# EAGLE design TAStm32_v3 (EAGLE 9.6.0)
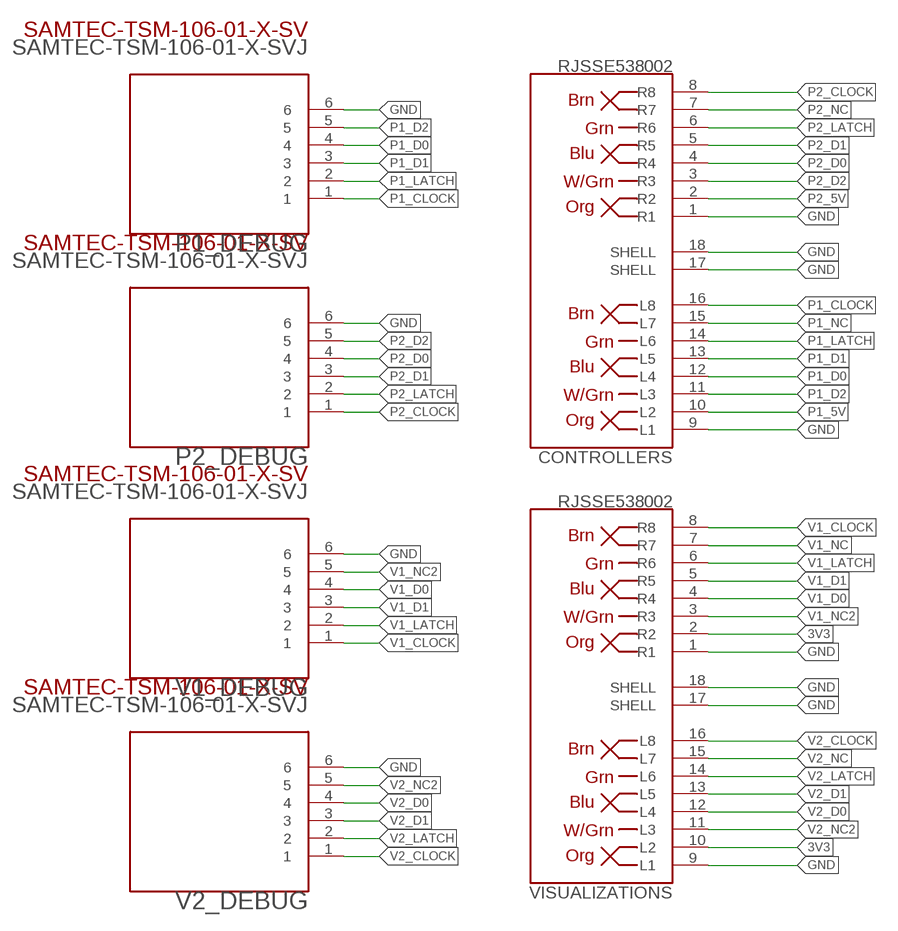
[diagram p0: schematic, sheet 1, part 1 of 2]
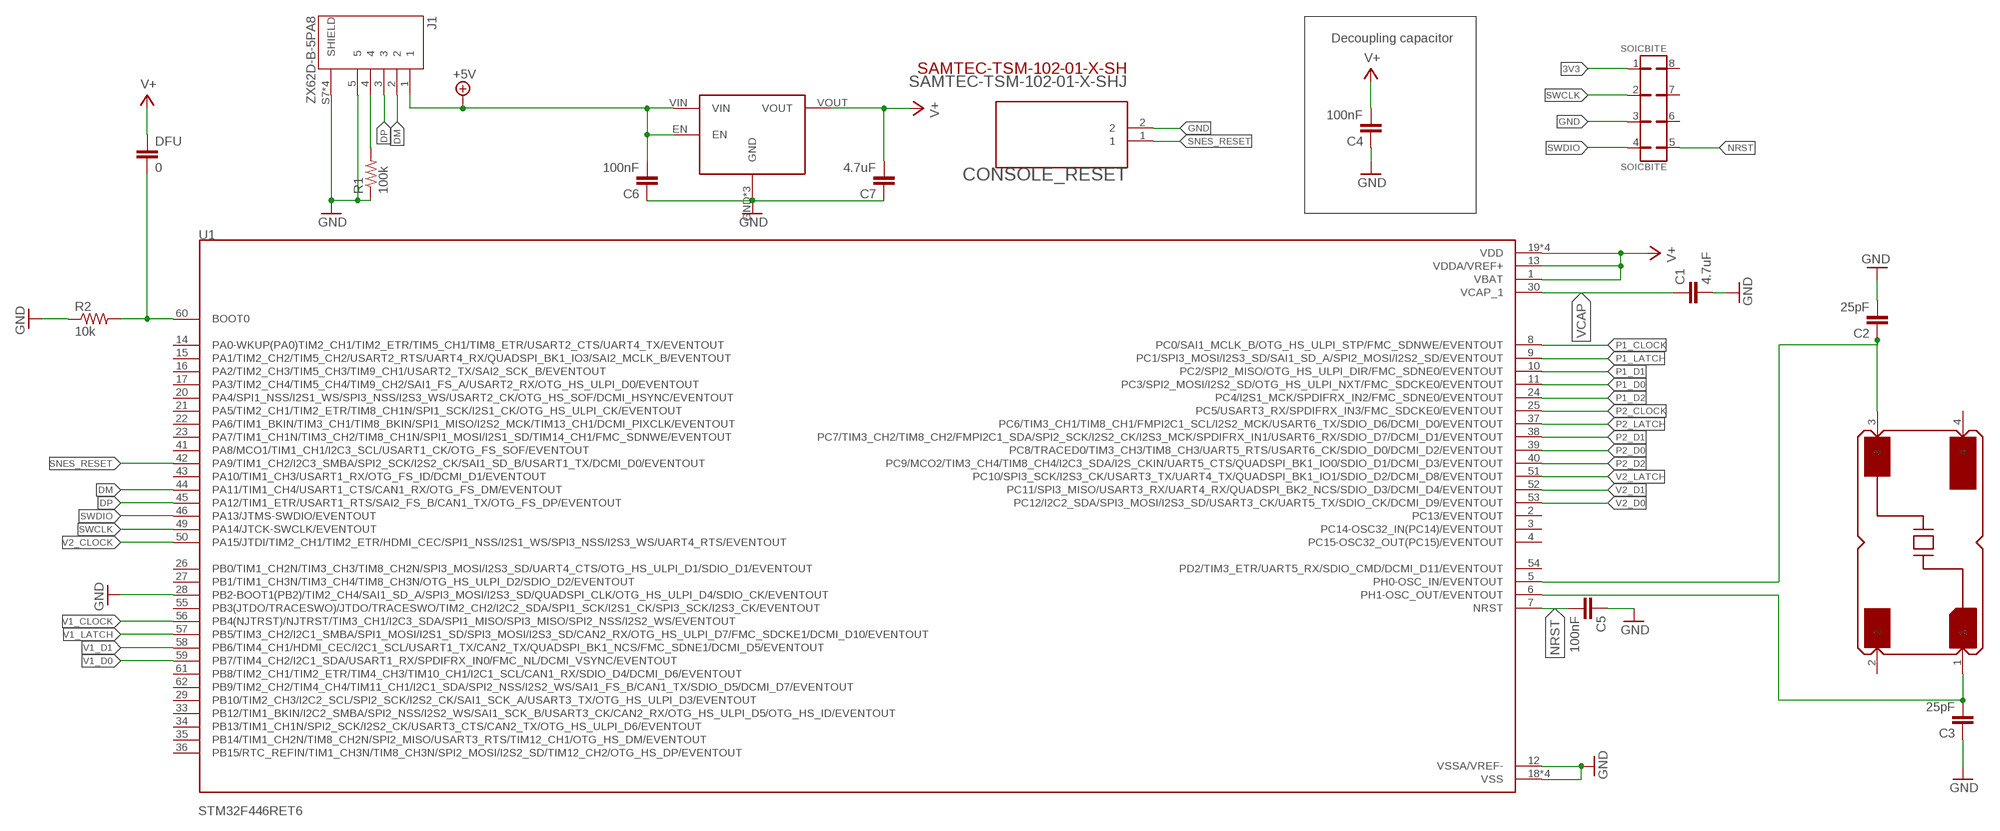
[diagram p1: schematic, sheet 1, part 2 of 2]

## Parts
C1  4.7uF  C-EUC0805K  [C0805K]
C2  25pF  C-EUC0805K  [C0805K]
C3  25pF  C-EUC0805K  [C0805K]
C4  100nF  C-EUC0805K  [C0805K]
C5  100nF  C-EUC0805K  [C0805K]
C6  100nF  C-EUC0805K  [C0805K]
C7  4.7uF  C-EUC0805K  [C0805K]
CONSOLE_RESET  SAMTEC-TSM-102-01-X-SHJ  [SAMTEC-TSM-102-01-X-SH]
CONTROLLERS  RJSSE538002  [AMPHENOL_RJSSE538002]
DFU  0  C-EUC0603  [C0603]
J1  ZX62D-B-5PA8  [HIROSE_ZX62D-B-5PA8]
P1_DEBUG  SAMTEC-TSM-106-01-X-SVJ  [SAMTEC-TSM-106-01-X-SV]
P2_DEBUG  SAMTEC-TSM-106-01-X-SVJ  [SAMTEC-TSM-106-01-X-SV]
R1  100k  R-US_R0805  [R0805]
R2  10k  R-US_R0805  [R0805]
SOICBITE  SOICBITE  [SOICBITE]
U1  STM32F446RET6  [QFP50P1200X1200X160-64N]
V1_DEBUG  SAMTEC-TSM-106-01-X-SVJ  [SAMTEC-TSM-106-01-X-SV]
V2_DEBUG  SAMTEC-TSM-106-01-X-SVJ  [SAMTEC-TSM-106-01-X-SV]
V_REG  S-1172B33-U5T1G  [S-1172B33-U5T1G]
VISUALIZATIONS  RJSSE538002  [AMPHENOL_RJSSE538002]
XTAL  ABMM-8.000MHZ-B2-T  [DFN-4]

## Nets
3V3: C4.2 C7.2 DFU.1 SOICBITE.1 U1.1(VBAT) U1.13(VDDA/VREF+) U1.19(VDD) U1.32(VDD) U1.48(VDD) U1.64(VDD) V_REG.VOUT VISUALIZATIONS.2(R2) VISUALIZATIONS.10(L2) ; supply symbol labelled V+
+5V: C6.2 J1.1 V_REG.EN V_REG.VIN
BOOT0: DFU.2 R2.2 U1.60(BOOT0)
DM: J1.2 U1.44(PA11/TIM1_CH4/USART1_CTS/CAN1_RX/OTG_FS_DM/EVENTOUT)
DP: J1.3 U1.45(PA12/TIM1_ETR/USART1_RTS/SAI2_FS_B/CAN1_TX/OTG_FS_DP/EVENTOUT)
GND: C1.2 C2.2 C3.1 C4.1 C5.1 C6.1 C7.1 CONSOLE_RESET.2 CONTROLLERS.1(R1) CONTROLLERS.9(L1) CONTROLLERS.17(SHELL) CONTROLLERS.18(SHELL) J1.5 J1.S7(SHIELD) J1.S8(SHIELD) J1.S9(SHIELD) J1.S10(SHIELD) P1_DEBUG.6 P2_DEBUG.6 R1.1 R2.1 SOICBITE.3 U1.12(VSSA/VREF-) U1.18(VSS) U1.28(PB2-BOOT1(PB2)/TIM2_CH4/SAI1_SD_A/SPI3_MOSI/I2S3_SD/QUADSPI_CLK/OTG_HS_ULPI_D4/SDIO_CK/EVENTOUT) U1.31(VSS) U1.47(VSS) U1.63(VSS) V1_DEBUG.6 V2_DEBUG.6 V_REG.GND V_REG.GND2(GND) V_REG.GND3(GND) VISUALIZATIONS.1(R1) VISUALIZATIONS.9(L1) VISUALIZATIONS.17(SHELL) VISUALIZATIONS.18(SHELL)
ID: J1.4 R1.2
NRST: C5.2 SOICBITE.5 U1.7(NRST)
P1_5V: CONTROLLERS.10(L2)
P1_CLOCK: CONTROLLERS.16(L8) P1_DEBUG.1 U1.8(PC0/SAI1_MCLK_B/OTG_HS_ULPI_STP/FMC_SDNWE/EVENTOUT)
P1_D0: CONTROLLERS.12(L4) P1_DEBUG.4 U1.11(PC3/SPI2_MOSI/I2S2_SD/OTG_HS_ULPI_NXT/FMC_SDCKE0/EVENTOUT)
P1_D1: CONTROLLERS.13(L5) P1_DEBUG.3 U1.10(PC2/SPI2_MISO/OTG_HS_ULPI_DIR/FMC_SDNE0/EVENTOUT)
P1_D2: CONTROLLERS.11(L3) P1_DEBUG.5 U1.24(PC4/I2S1_MCK/SPDIFRX_IN2/FMC_SDNE0/EVENTOUT)
P1_LATCH: CONTROLLERS.14(L6) P1_DEBUG.2 U1.9(PC1/SPI3_MOSI/I2S3_SD/SAI1_SD_A/SPI2_MOSI/I2S2_SD/EVENTOUT)
P1_NC: CONTROLLERS.15(L7)
P2_5V: CONTROLLERS.2(R2)
P2_CLOCK: CONTROLLERS.8(R8) P2_DEBUG.1 U1.25(PC5/USART3_RX/SPDIFRX_IN3/FMC_SDCKE0/EVENTOUT)
P2_D0: CONTROLLERS.4(R4) P2_DEBUG.4 U1.39(PC8/TRACED0/TIM3_CH3/TIM8_CH3/UART5_RTS/USART6_CK/SDIO_D0/DCMI_D2/EVENTOUT)
P2_D1: CONTROLLERS.5(R5) P2_DEBUG.3 U1.38(PC7/TIM3_CH2/TIM8_CH2/FMPI2C1_SDA/SPI2_SCK/I2S2_CK/I2S3_MCK/SPDIFRX_IN1/USART6_RX/SDIO_D7/DCMI_D1/EVENTOUT)
P2_D2: CONTROLLERS.3(R3) P2_DEBUG.5 U1.40(PC9/MCO2/TIM3_CH4/TIM8_CH4/I2C3_SDA/I2S_CKIN/UART5_CTS/QUADSPI_BK1_IO0/SDIO_D1/DCMI_D3/EVENTOUT)
P2_LATCH: CONTROLLERS.6(R6) P2_DEBUG.2 U1.37(PC6/TIM3_CH1/TIM8_CH1/FMPI2C1_SCL/I2S2_MCK/USART6_TX/SDIO_D6/DCMI_D0/EVENTOUT)
P2_NC: CONTROLLERS.7(R7)
SNES_RESET: CONSOLE_RESET.1 U1.42(PA9/TIM1_CH2/I2C3_SMBA/SPI2_SCK/I2S2_CK/SAI1_SD_B/USART1_TX/DCMI_D0/EVENTOUT)
SWCLK: SOICBITE.2 U1.49(PA14/JTCK-SWCLK/EVENTOUT)
SWDIO: SOICBITE.4 U1.46(PA13/JTMS-SWDIO/EVENTOUT)
V1_CLOCK: U1.56(PB4(NJTRST)/NJTRST/TIM3_CH1/I2C3_SDA/SPI1_MISO/SPI3_MISO/SPI2_NSS/I2S2_WS/EVENTOUT) V1_DEBUG.1 VISUALIZATIONS.8(R8)
V1_D0: U1.59(PB7/TIM4_CH2/I2C1_SDA/USART1_RX/SPDIFRX_IN0/FMC_NL/DCMI_VSYNC/EVENTOUT) V1_DEBUG.4 VISUALIZATIONS.4(R4)
V1_D1: U1.58(PB6/TIM4_CH1/HDMI_CEC/I2C1_SCL/USART1_TX/CAN2_TX/QUADSPI_BK1_NCS/FMC_SDNE1/DCMI_D5/EVENTOUT) V1_DEBUG.3 VISUALIZATIONS.5(R5)
V1_LATCH: U1.57(PB5/TIM3_CH2/I2C1_SMBA/SPI1_MOSI/I2S1_SD/SPI3_MOSI/I2S3_SD/CAN2_RX/OTG_HS_ULPI_D7/FMC_SDCKE1/DCMI_D10/EVENTOUT) V1_DEBUG.2 VISUALIZATIONS.6(R6)
V1_NC: VISUALIZATIONS.7(R7)
V1_NC2: V1_DEBUG.5 VISUALIZATIONS.3(R3)
V2_CLOCK: U1.50(PA15/JTDI/TIM2_CH1/TIM2_ETR/HDMI_CEC/SPI1_NSS/I2S1_WS/SPI3_NSS/I2S3_WS/UART4_RTS/EVENTOUT) V2_DEBUG.1 VISUALIZATIONS.16(L8)
V2_D0: U1.53(PC12/I2C2_SDA/SPI3_MOSI/I2S3_SD/USART3_CK/UART5_TX/SDIO_CK/DCMI_D9/EVENTOUT) V2_DEBUG.4 VISUALIZATIONS.12(L4)
V2_D1: U1.52(PC11/SPI3_MISO/USART3_RX/UART4_RX/QUADSPI_BK2_NCS/SDIO_D3/DCMI_D4/EVENTOUT) V2_DEBUG.3 VISUALIZATIONS.13(L5)
V2_LATCH: U1.51(PC10/SPI3_SCK/I2S3_CK/USART3_TX/UART4_TX/QUADSPI_BK1_IO1/SDIO_D2/DCMI_D8/EVENTOUT) V2_DEBUG.2 VISUALIZATIONS.14(L6)
V2_NC: VISUALIZATIONS.15(L7)
V2_NC2: V2_DEBUG.5 VISUALIZATIONS.11(L3)
VCAP: C1.1 U1.30(VCAP_1)
XTAL1: C2.1 U1.5(PH0-OSC_IN/EVENTOUT) XTAL.3
XTAL2: C3.2 U1.6(PH1-OSC_OUT/EVENTOUT) XTAL.1
Unconnected: SOICBITE.6 SOICBITE.7 SOICBITE.8 U1.2(PC13/EVENTOUT) U1.3(PC14-OSC32_IN(PC14)/EVENTOUT) U1.4(PC15-OSC32_OUT(PC15)/EVENTOUT) U1.14(PA0-WKUP(PA0)TIM2_CH1/TIM2_ETR/TIM5_CH1/TIM8_ETR/USART2_CTS/UART4_TX/EVENTOUT) U1.15(PA1/TIM2_CH2/TIM5_CH2/USART2_RTS/UART4_RX/QUADSPI_BK1_IO3/SAI2_MCLK_B/EVENTOUT) U1.16(PA2/TIM2_CH3/TIM5_CH3/TIM9_CH1/USART2_TX/SAI2_SCK_B/EVENTOUT) U1.17(PA3/TIM2_CH4/TIM5_CH4/TIM9_CH2/SAI1_FS_A/USART2_RX/OTG_HS_ULPI_D0/EVENTOUT) U1.20(PA4/SPI1_NSS/I2S1_WS/SPI3_NSS/I2S3_WS/USART2_CK/OTG_HS_SOF/DCMI_HSYNC/EVENTOUT) U1.21(PA5/TIM2_CH1/TIM2_ETR/TIM8_CH1N/SPI1_SCK/I2S1_CK/OTG_HS_ULPI_CK/EVENTOUT) U1.22(PA6/TIM1_BKIN/TIM3_CH1/TIM8_BKIN/SPI1_MISO/I2S2_MCK/TIM13_CH1/DCMI_PIXCLK/EVENTOUT) U1.23(PA7/TIM1_CH1N/TIM3_CH2/TIM8_CH1N/SPI1_MOSI/I2S1_SD/TIM14_CH1/FMC_SDNWE/EVENTOUT) U1.26(PB0/TIM1_CH2N/TIM3_CH3/TIM8_CH2N/SPI3_MOSI/I2S3_SD/UART4_CTS/OTG_HS_ULPI_D1/SDIO_D1/EVENTOUT) U1.27(PB1/TIM1_CH3N/TIM3_CH4/TIM8_CH3N/OTG_HS_ULPI_D2/SDIO_D2/EVENTOUT) U1.29(PB10/TIM2_CH3/I2C2_SCL/SPI2_SCK/I2S2_CK/SAI1_SCK_A/USART3_TX/OTG_HS_ULPI_D3/EVENTOUT) U1.33(PB12/TIM1_BKIN/I2C2_SMBA/SPI2_NSS/I2S2_WS/SAI1_SCK_B/USART3_CK/CAN2_RX/OTG_HS_ULPI_D5/OTG_HS_ID/EVENTOUT) U1.34(PB13/TIM1_CH1N/SPI2_SCK/I2S2_CK/USART3_CTS/CAN2_TX/OTG_HS_ULPI_D6/EVENTOUT) U1.35(PB14/TIM1_CH2N/TIM8_CH2N/SPI2_MISO/USART3_RTS/TIM12_CH1/OTG_HS_DM/EVENTOUT) U1.36(PB15/RTC_REFIN/TIM1_CH3N/TIM8_CH3N/SPI2_MOSI/I2S2_SD/TIM12_CH2/OTG_HS_DP/EVENTOUT) U1.41(PA8/MCO1/TIM1_CH1/I2C3_SCL/USART1_CK/OTG_FS_SOF/EVENTOUT) U1.43(PA10/TIM1_CH3/USART1_RX/OTG_FS_ID/DCMI_D1/EVENTOUT) U1.54(PD2/TIM3_ETR/UART5_RX/SDIO_CMD/DCMI_D11/EVENTOUT) U1.55(PB3(JTDO/TRACESWO)/JTDO/TRACESWO/TIM2_CH2/I2C2_SDA/SPI1_SCK/I2S1_CK/SPI3_SCK/I2S3_CK/EVENTOUT) U1.61(PB8/TIM2_CH1/TIM2_ETR/TIM4_CH3/TIM10_CH1/I2C1_SCL/CAN1_RX/SDIO_D4/DCMI_D6/EVENTOUT) U1.62(PB9/TIM2_CH2/TIM4_CH4/TIM11_CH1/I2C1_SDA/SPI2_NSS/I2S2_WS/SAI1_FS_B/CAN1_TX/SDIO_D5/DCMI_D7/EVENTOUT) XTAL.2 XTAL.4

## Notes on the sheet
- Decoupling capacitor

## Library data of the parts
C1-C7 DFU = rcl:C-EU: CAPACITOR, European symbol; SPICEPREFIX: C
CONSOLE_RESET = SAMTEC-TSM-102-01-X-SH:SAMTEC-TSM-102-01-X-SH; AVAILABILITY: Unavailable; DESCRIPTION: Connector Header Surface Mount, Right Angle 2 position 0.100 _2.54mm_; MF: Samtec; MP: TSM-102-01-F-SH; PACKAGE: None; PRICE: None
CONTROLLERS VISUALIZATIONS = RJSSE538002:RJSSE538002: Conn RJ-45 F 16 POS 1.27mm Solder RA SMD 16 Terminal 2 Port Cat 5; AVAILABILITY: Unavailable; DESCRIPTION: Jack Modular Connector 8p8c _RJ45, Ethernet_ 90° Angle _Right_ Shielded, EMI Finger; MF: Amphenol Commercial Products; MP: RJSSE538002; PACKAGE: None; PRICE: None
J1 = ZX62D-B-5PA8:ZX62D-B-5PA8: CONN RCPT USB; AVAILABILITY: Unavailable; DESCRIPTION: 5 Pin Single Port USB 2.0 Micro B Bottom Mount Through Hole Receptacle Male; MF: Hirose; MP: ZX62D-B-5PA8; PACKAGE: None; PRICE: None
P1_DEBUG P2_DEBUG V1_DEBUG V2_DEBUG = SAMTEC-TSM-106-01-X-SV:SAMTEC-TSM-106-01-X-SV; AVAILABILITY: Unavailable; DESCRIPTION: Connector Header Surface Mount 6 position 0.100 _2.54mm_; MF: Samtec; MP: TSM-106-01-L-SV; PACKAGE: None; PRICE: None
R1 R2 = rcl:R-US_: RESISTOR, American symbol; SPICEPREFIX: R
SOICBITE = SOICbite_Eagle:SOICBITE: SOICbite footprint Allows for direct clipping of a SOIC-8 Testclip onto a PCB edge for Programming/Debugging purposes without extra components. Original footprint created by: Simon Merrit Adapted to Eagle by: Chiel Voswijk (Foxhood) NOTE: Footprint is to be used on the edge of a PCB and may require the use of thin traces for accessing the inner pads. This may violate some Design Rules! One can often ignore these, but understand working is NOT guaranteed.
U1 = STM32F446RET6:STM32F446RET6: MCU 32-Bit STM32 ARM Cortex M4 RISC 512KB Flash 2.5V/3.3V 64-Pin LQFP Tray; DESCRIPTION: MCU 32-Bit STM32 ARM Cortex M4 RISC 512KB Flash 2.5V/3.3V 64-Pin LQFP Tray; MF: STMicroelectronics; MP: STM32F446RET6; PACKAGE: LQFP-64 STMicroelectronics
V_REG = S-1172B33-U5T1G:S-1172B33-U5T1G
XTAL = ABMM-8.000MHZ-B2-T:ABMM-8.000MHZ-B2-T: CRYSTAL 24MHZ 18PF SMD; AVAILABILITY: Good; DESCRIPTION: Crystal 8MHz ??20ppm _Tol_ ??50ppm _Stability_ 18pF FUND 70Ohm 4-Pin CSMD T/R; MF: Abracon; MP: ABMM-8.000MHZ-B2-T; PACKAGE: SMD-4 Abracon; PRICE: 0.61 USD

## Board
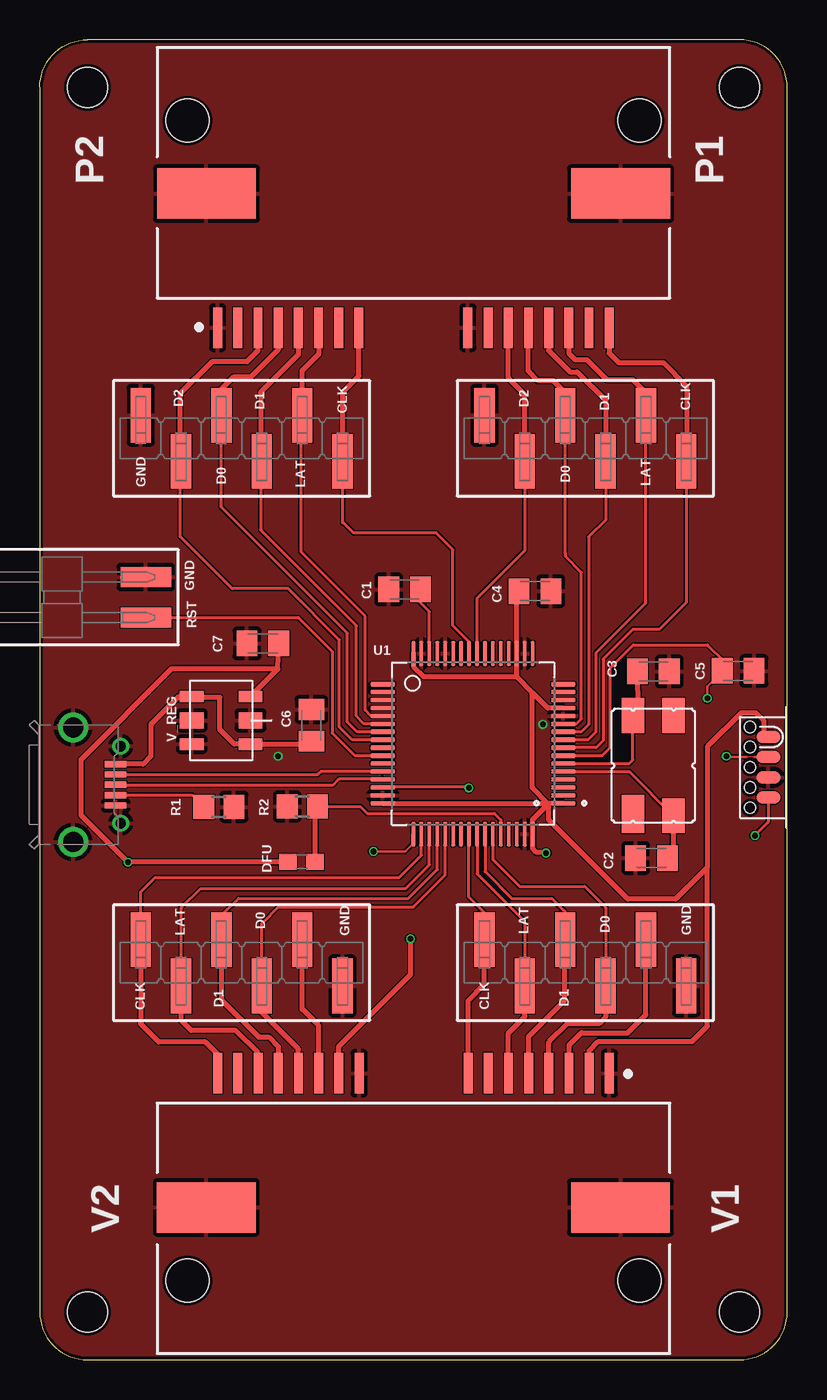
[diagram p2: board, top side]
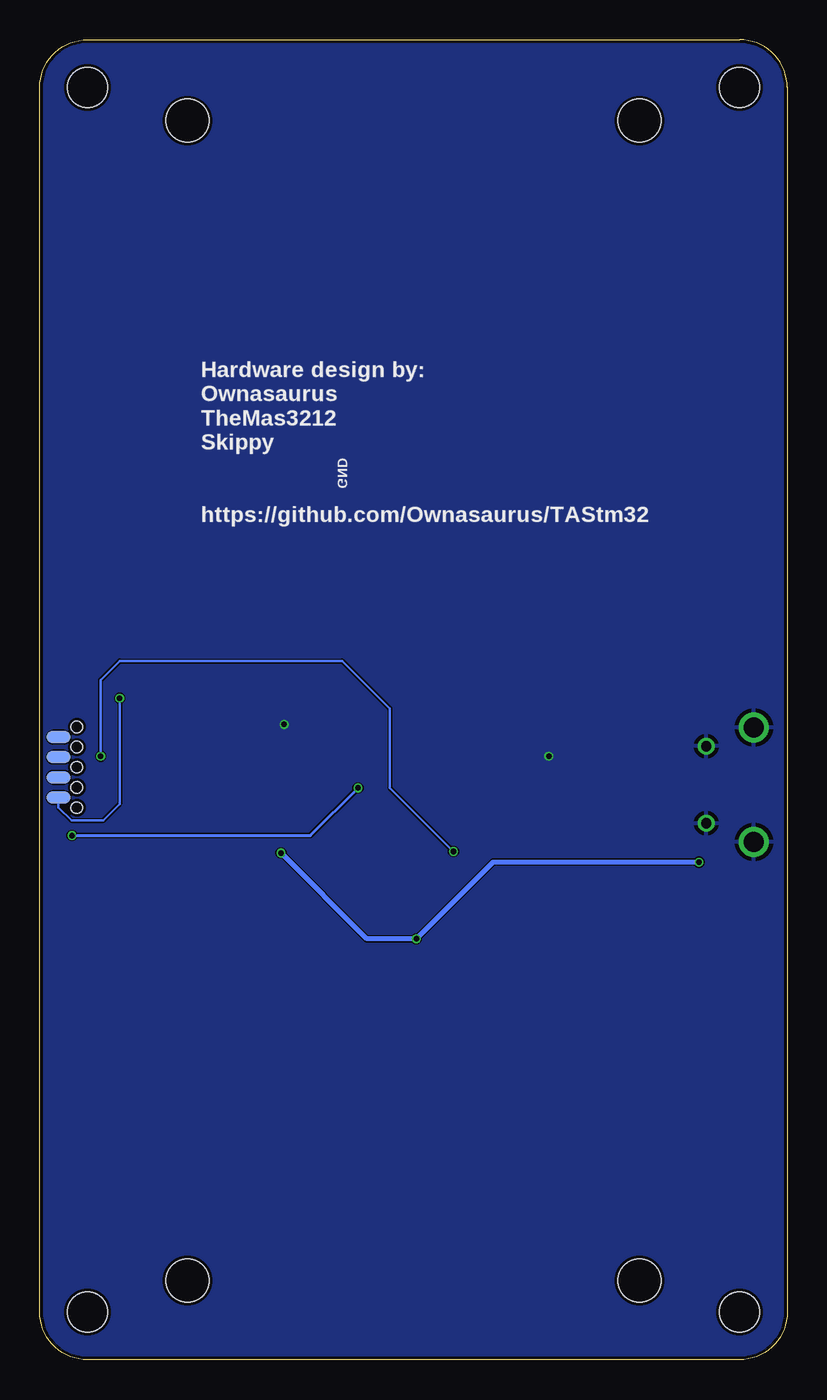
[diagram p3: board, bottom side, seen from below]

Size 47.03 x 83.08 mm. Coordinates in mm from the lower left corner, seen from the top.
Outline: 3,0 44.03,0 arc90 47.03,3 47.03,80.08 arc90 44.03,83.08 3,83.08 arc90 0,80.08 0,3 arc90 3,0
Copper layers (1*16): Top 0.035mm / dielectric 1.53mm / Bottom 0.035mm
Design rules "circuithub-minimum-design-rules-with-tented-vias": minimum track width 3mil, minimum drill 0.15mm, track to track 3mil, track to pad 3mil, pad to pad 3mil, via to via 3mil, smd to smd 3mil, copper to edge 8mil, drill to drill 8mil, minimum pad ring 4mil, minimum via ring 4mil, stop-mask expansion 4mil, vias tented up to drill 25mil, thermal gap 10mil
Holes 2.5 mm at 3,3 44.03,3 44.03,80.08 3,80.08

### Footprints (pad centres in the part's own frame; a part is rotated, then mirrored left to right if it is on the bottom)
C0805K = smd 1.3 x 1.6: 1 -1,0; 2 1,0
SAMTEC-TSM-102-01-X-SH = smd 1.27 x 3.18: 1 -1.27,-5.283; 2 1.27,-5.283
AMPHENOL_RJSSE538002 = smd 0.56 x 2.54: 1 12.325,13.04; 2 11.055,13.04; 3 9.785,13.04; 4 8.515,13.04; 5 7.245,13.04; 6 5.975,13.04; 7 4.705,13.04; 8 3.435,13.04; 9 -3.425,13.04; 10 -4.695,13.04; 11 -5.965,13.04; 12 -7.235,13.04; 13 -8.505,13.04; 14 -9.775,13.04; 15 -11.045,13.04; 16 -12.315,13.04 | smd 6.22 x 3.18: 17 -13.035,4.59; 18 13.025,4.59 | hole 2.69: -14.225,0; 14.225,0
C0603 = smd 1.1 x 1: 1 -0.85,0; 2 0.85,0
HIROSE_ZX62D-B-5PA8 = smd 1.35 x 0.4: 1 2.675,1.3; 2 2.675,0.65; 3 2.675,0; 4 2.675,-0.65; 5 2.675,-1.3 | drill 0.65 pad 1.05: S7 3,2.425; S8 3,-2.425 | drill 1.25 pad 1.9: S9 0,3.6; S10 0,-3.6
SAMTEC-TSM-106-01-X-SV = smd 1.27 x 3.43: 1 -6.35,1.46; 2 -3.81,-1.46; 3 -1.27,1.46; 4 1.27,-1.46; 5 3.81,1.46; 6 6.35,-1.46
R0805 = smd 1.3 x 1.5: 1 -0.95,0; 2 0.95,0
SOICBITE = smd 0.8 x 1.5: 1 1.905,0.75; 2 0.635,0.75; 3 -0.635,0.75; 4 -1.905,0.75 | smd 0.8 x 1.5 bottom: 5 -1.905,0.75; 6 -0.635,0.75; 7 0.635,0.75; 8 1.905,0.75 | hole 0.7: -2.54,1.905; -1.27,1.905; 0,1.905; 1.27,1.905; 2.54,1.905
QFP50P1200X1200X160-64N = smd 1.56 x 0.28: 1 -5.68,3.75; 2 -5.68,3.25; 3 -5.68,2.75; 4 -5.68,2.25; 5 -5.68,1.75; 6 -5.68,1.25; 7 -5.68,0.75; 8 -5.68,0.25; 9 -5.68,-0.25; 10 -5.68,-0.75; 11 -5.68,-1.25; 12 -5.68,-1.75; 13 -5.68,-2.25; 14 -5.68,-2.75; 15 -5.68,-3.25; 16 -5.68,-3.75; 33 5.68,-3.75; 34 5.68,-3.25; 35 5.68,-2.75; 36 5.68,-2.25; 37 5.68,-1.75; 38 5.68,-1.25; 39 5.68,-0.75; 40 5.68,-0.25; 41 5.68,0.25; 42 5.68,0.75; 43 5.68,1.25; 44 5.68,1.75; 45 5.68,2.25; 46 5.68,2.75; 47 5.68,3.25; 48 5.68,3.75 | smd 0.28 x 1.56: 17 -3.75,-5.68; 18 -3.25,-5.68; 19 -2.75,-5.68; 20 -2.25,-5.68; 21 -1.75,-5.68; 22 -1.25,-5.68; 23 -0.75,-5.68; 24 -0.25,-5.68; 25 0.25,-5.68; 26 0.75,-5.68; 27 1.25,-5.68; 28 1.75,-5.68; 29 2.25,-5.68; 30 2.75,-5.68; 31 3.25,-5.68; 32 3.75,-5.68; 49 3.75,5.68; 50 3.25,5.68; 51 2.75,5.68; 52 2.25,5.68; 53 1.75,5.68; 54 1.25,5.68; 55 0.75,5.68; 56 0.25,5.68; 57 -0.25,5.68; 58 -0.75,5.68; 59 -1.25,5.68; 60 -1.75,5.68; 61 -2.25,5.68; 62 -2.75,5.68; 63 -3.25,5.68; 64 -3.75,5.68
S-1172B33-U5T1G = smd 0.7 x 1.5: EN -1.5,-1.85; GND3 1.5,-1.85; VIN 1.5,1.85; VOUT -1.5,1.85 | smd 1 x 1.5: GND 0,-1.85; GND2 0,1.85
DFN-4 = smd 2.2 x 1.4: 1 0.45,1.32; 2 0.45,3.87; 3 6.75,3.87 | smd 2.4 x 1.4: 4 6.65,1.32

### Placement (x,y rotation side)
C1  22.96,48.48 180 top
C2  38.49,31.58 180 top
C3  38.61,43.32 180 top
C4  31.16,48.37 180 top
C5  43.94,43.36 180 top
C6  17.09,39.93 270 top
C7  14.04,45.09 0 top
CONSOLE_RESET  1.4,47.99 90 top
CONTROLLERS  23.52,77.99 180 top
DFU  16.48,31.33 0 top
J1  2.1,36.19 0 top
P1_DEBUG  34.33,57.99 180 top
P2_DEBUG  12.7,57.99 180 top
R1  11.27,34.8 180 top
R2  16.52,34.82 0 top
SOICBITE  46.6,37.29 90 top
U1  27.26,38.77 180 top
V1_DEBUG  34.33,24.99 0 top
V2_DEBUG  12.7,24.99 0 top
V_REG  11.41,40.24 270 top
VISUALIZATIONS  23.52,4.99 0 top
XTAL  36,40.99 270 top

### Tracks (layer width: path | path; a pad name or v marks a point on that pad's centre or on a via)
3V3  (via drill 0.35)
  Top 0.305: U1.19 30.01,44.99 | 30.01,44.99 30.01,48.17 C4.2 | V_REG.VOUT 14.99,43.47 | 14.99,43.47 C7.2 | U1.1 32.03,35.02 | 32,34.99 31.01,34 U1.64 31.01,32.18 31.25,31.94 31.8,31.94 v31.85,31.89 | 32,34.99 32.03,35.02 | U1.13 31.97,41.02 31,41.99 | 31,41.99 30,42.99 | 30,42.99 30,44.98 30.01,44.99 | U1.32 23.52,43.64 24.16,42.99 30,42.99 | 31,41.99 31,36.03 30.98,36.01 31.97,35.02 | 32.03,35.02 31.97,35.02 | 31.97,35.02 32,34.99 | U1.48 31.97,35.02 | 14.99,43.47 14.97,43.49 8.3,43.49 2.6,37.79 2.6,34.27 v5.55,31.32 15.62,31.32 DFU.1 | SOICBITE.1 45.58,39.47 45.58,40.2 45.06,40.72 44.12,40.72 42,38.59 42,30.99 | 42,30.99 40,28.99 37,28.99 32.03,33.96 32.03,35.02 | 42,30.99 42,20.99 41.04,20.04 35.15,20.04 34.57,19.45 VISUALIZATIONS.2 | v23.33,26.5 23.33,24.25 18.82,19.74 VISUALIZATIONS.10
  Bottom 0.305: v5.55,31.32 18.51,31.32 v23.33,26.5 26.45,26.5 v31.85,31.89
+5V
  Top 0.305: J1.1 6.5,37.49 7,37.99 7,39.99 8.75,41.74 V_REG.EN 9.61,41.7 11.34,41.7 11.34,39.66 12.25,38.74 V_REG.VIN 16.85,38.74 C6.2
BOOT0
  Top 0.203: R2.2 20.17,34.82 20.6,34.39 28.6,34.39 29.01,33.98 U1.60
  Top 0.305: DFU.2 17.33,34.68 R2.2
DM
  Top 0.203: J1.2 17.5,36.84 17.7,37.04 21.56,37.04
  Top 0.254: U1.44 21.56,37.04
DP
  Top 0.203: 21.56,36.54 18.82,36.54 18.48,36.19 J1.3
  Top 0.254: U1.45 21.56,36.54
GND  (via drill 0.35)
  other vias: 15,37.99 31.65,39.99
  pour Bottom: 0,83.09 48.36,83.09 48.36,-0.01 0,-0.01
  pour Top: 0,82.99 48,82.99 48,-0.01 0,-0.01
ID
  Top 0.203: J1.4 9.58,35.54 R1.2
NRST  (via drill 0.35)
  Top 0.152: C5.2 42,42.37 v42,41.64
  Top 0.203: U1.7 35.39,38.03 35.91,38.54 35.91,43.54 37.36,44.99 42,44.99 42.99,44 C5.2
  Bottom 0.152: SOICBITE.5 45.85,34.77 45.03,33.94 43.05,33.94 42,34.99 v42,41.64
P1_CLOCK
  Top 0.203: U1.8 35,38.52 35.45,38.97 35.45,44.09 37.35,45.99 39,45.99 40.68,47.67 P1_DEBUG.1
  Top 0.305: P1_DEBUG.1 40.7,56.56 40.7,61.29 39.25,62.75 36.43,62.75 35.83,63.35 CONTROLLERS.16
P1_D0
  Top 0.203: P1_DEBUG.4 33.06,50.77 33.05,50.59 34.08,49.55 34.08,40.34 33.76,40.02 U1.11
  Top 0.305: P1_DEBUG.4 33.06,60.88 32.3,61.64 31.34,61.64 30.73,62.24 30.73,64.93 CONTROLLERS.12
P1_D1
  Top 0.203: U1.10 34.08,39.52 34.54,39.98 34.54,51.8 35.6,52.86 P1_DEBUG.3
  Top 0.305: P1_DEBUG.3 35.61,60.39 33.82,62.17 33.38,62.17 32.02,63.53 CONTROLLERS.13
P1_D2
  Top 0.203: P1_DEBUG.5 30.52,50.94 30.53,50.94 27.51,47.92 U1.24
  Top 0.305: P1_DEBUG.5 30.52,60.46 30.5,60.78 29.48,61.8 CONTROLLERS.11
P1_LATCH
  Top 0.203: U1.9 34.5,39.03 34.99,39.52 34.99,44.49 38.14,47.63 P1_DEBUG.2
  Top 0.305: P1_DEBUG.2 37.81,59.55 38,59.74 38,60.99 37.31,61.68 35.69,61.68 34.42,62.94 33.69,62.94 33.29,63.34 CONTROLLERS.14
P2_CLOCK
  Top 0.203: U1.25 27,45.2 26,46.2 26,50.99 24.95,52.04 19.75,52.04 19.13,52.66 19.05,52.66 P2_DEBUG.1
  Top 0.305: P2_DEBUG.1 19.05,60.91 19.07,60.91 20.08,61.92 CONTROLLERS.8
P2_D0
  Top 0.203: U1.39 19.98,39.52 19.36,40.14 19.36,45.73 11.43,53.66 11.43,59.32 P2_DEBUG.4
  Top 0.305: CONTROLLERS.4 15,63.56 13.27,61.84 12.17,61.84 11.43,61.09 11.43,59.32
P2_D1
  Top 0.203: U1.38 20.4,40.02 19.92,40.5 19.92,46.2 13.9,52.22 13.9,56.36
  Top 0.305: P2_DEBUG.3 13.9,56.63 | 13.9,56.63 13.9,60.89 16.27,63.26 CONTROLLERS.5 | 13.9,56.63 13.9,56.36
P2_D2
  Top 0.203: U1.40 19.68,39.02 18.86,39.84 18.86,45.31 15.64,48.53 12.11,48.53 8.84,51.8 8.84,56.32
  Top 0.305: P2_DEBUG.5 8.81,56.64 | 8.81,56.64 8.81,56.32 8.84,56.32 | 8.81,56.64 8.81,56.99 8.81,60.79 10.84,62.82 13.03,62.82 13.73,63.52 CONTROLLERS.3
P2_LATCH
  Top 0.203: U1.37 20.84,40.53 20.47,40.89 20.47,46.8 16.42,50.85 16.42,59.38
  Top 0.305: CONTROLLERS.6 17.54,63.29 16.51,62.26 P2_DEBUG.2 16.43,59.37 16.42,59.38
SNES_RESET
  Top 0.203: CONSOLE_RESET.1 16.27,46.72 18.4,44.59 18.4,39.44 19.82,38.02 U1.42
SWCLK  (via drill 0.35)
  Top 0.076: 45,37.94 44.45,37.94
  Top 0.152: v21,31.99 23,31.99 23.51,32.5 | SOICBITE.2 45,37.94 | 44.45,37.94 43.25,37.94 v43.2,37.99
  Top 0.254: 23.51,32.5 U1.49
  Bottom 0.152: v21,31.99 25,35.99 25,40.99 28,43.99 42,43.99 43.2,42.79 v43.2,37.99
SWDIO  (via drill 0.35)
  Top 0.203: SOICBITE.4 45.85,33.84 v45,32.99 | v27,35.99 26.95,36.04 21.6,36.04 U1.46
  Bottom 0.203: v45,32.99 30,32.99 v27,35.99
V1_CLOCK
  Top 0.203: U1.56 27,29.13 28.01,28.12 27.98,28.12 V1_DEBUG.1
  Top 0.305: VISUALIZATIONS.8 26.95,22.6 27.97,23.62 27.98,23.68 V1_DEBUG.1
V1_D0
  Top 0.203: U1.59 28.51,31.48 30.2,29.79 34.28,29.79 35.61,28.47 35.6,28.47 V1_DEBUG.4
  Top 0.305: VISUALIZATIONS.4 32.03,20.01 33.18,21.15 35.2,21.15 35.59,21.55 35.6,21.59 V1_DEBUG.4
V1_D1
  Top 0.203: U1.58 28.01,32.99 28.02,32.99 28.02,30.72 29.7,29.04 32.23,29.04 33.03,28.23 33.03,26.42
  Top 0.305: V1_DEBUG.3 33.03,26.42 33.03,22.62 30.76,20.35 VISUALIZATIONS.5
V1_LATCH
  Top 0.203: U1.57 27.52,30.59 30.51,27.59 30.52,27.47 V1_DEBUG.2
  Top 0.305: VISUALIZATIONS.6 29.49,20.55 30.51,21.58 30.52,21.62 V1_DEBUG.2
V1_NC2
  Top 0.305: VISUALIZATIONS.3 33.3,19.81 34.07,20.58 37,20.58 38.14,21.72 V1_DEBUG.5
V2_CLOCK
  Top 0.203: V2_DEBUG.1 6.35,29.44 7.26,30.35 22.6,30.35 24.01,31.75 U1.50
  Top 0.305: VISUALIZATIONS.16 11.2,19.21 10.41,20 7.48,20 6.34,21.13 6.35,21.2 V2_DEBUG.1
V2_D0
  Top 0.203: V2_DEBUG.4 13.97,27.47 13.99,27.48 15.01,28.49 23.5,28.49 25.51,30.5 U1.53
  Top 0.305: VISUALIZATIONS.12 16.28,19.56 13.97,21.87 V2_DEBUG.4
V2_D1
  Top 0.203: V2_DEBUG.3 11.43,27.98 11.46,27.99 12.51,29.05 23.2,29.05 25.01,30.86 U1.52
  Top 0.305: V2_DEBUG.3 11.43,22.67 13.78,20.32 14.39,20.32 15.01,19.7 VISUALIZATIONS.13
V2_LATCH
  Top 0.203: V2_DEBUG.2 8.89,28.46 8.92,28.46 10.1,29.64 23,29.64 24.51,31.15 U1.51
  Top 0.305: VISUALIZATIONS.14 13.74,19.3 12.31,20.73 9.53,20.73 8.89,21.36 V2_DEBUG.2
V2_NC2
  Top 0.305: VISUALIZATIONS.11 17.55,21.05 16.56,22.03 16.51,22.04 V2_DEBUG.5
VCAP
  Top 0.203: U1.30 24.51,47.08 23.91,47.68 C1.1
XTAL1
  Top 0.203: U1.5 37.09,37.02 XTAL.3
  Top 0.305: XTAL.3 39.87,32.09 39.37,31.59 C2.1
XTAL2
  Top 0.203: U1.6 37.08,37.52 37.32,37.76 XTAL.1
  Top 0.305: XTAL.1 37.66,40.88 C3.2

### Text on the board
tNames: P2 | P1 | D2 | D1 | CLK | D2 | D1 | CLK | GND | D0 | LAT | D0 | LAT | GND | RST | V_REG | LAT | D0 | GND | LAT | D0 | GND | CLK | D1 | CLK | D1 | V2 | V1
bNames: GND | Hardware design by: / Ownasaurus / TheMas3212 / Skippy / / / https://github.com/Ownasaurus/TAStm32